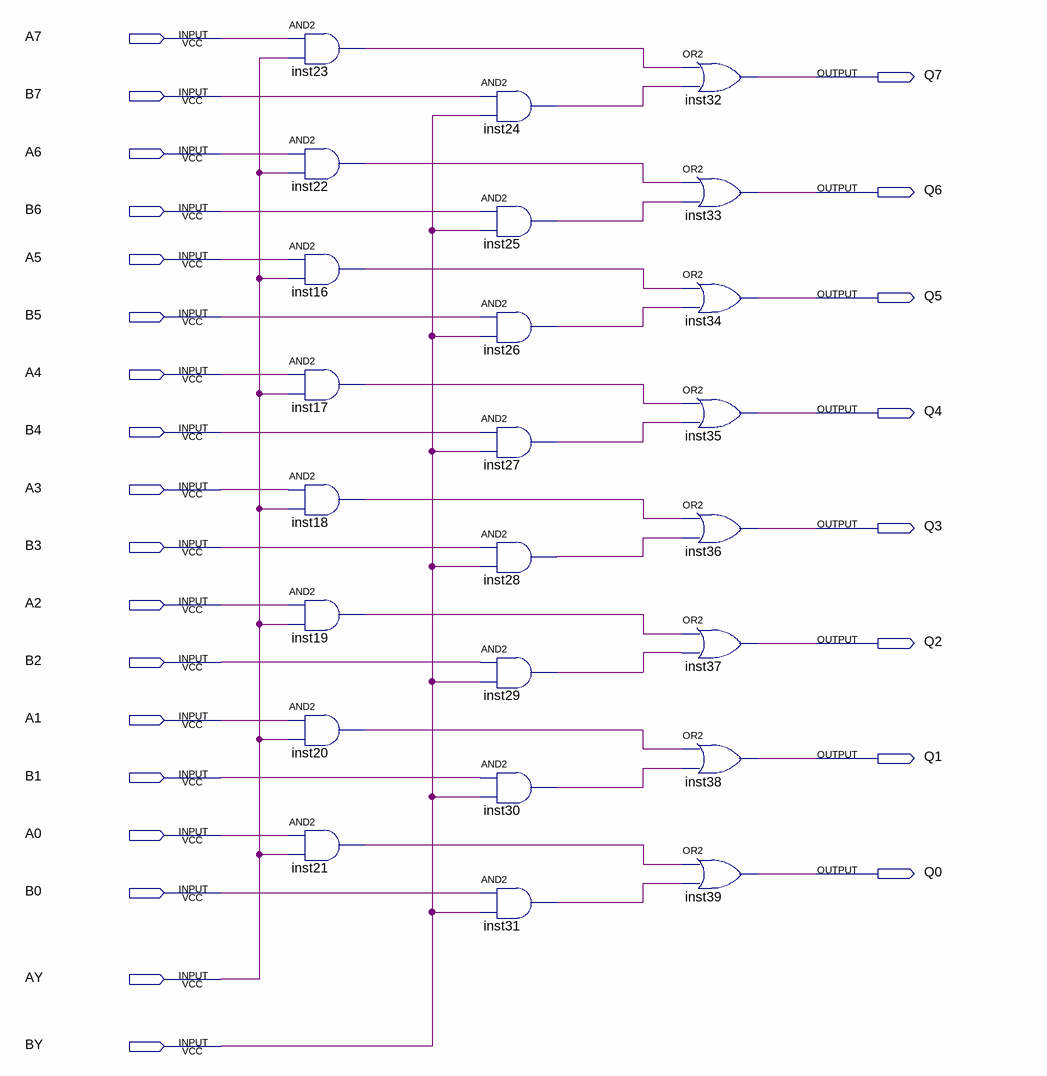
[diagram p0: schematic sheet]
// Quartus schematic tmux8.bdf as structural Verilog: 24 symbols, 26 pins
module tmux8 (
  input  A7,
  input  B7,
  input  A6,
  input  B6,
  input  A5,
  input  B5,
  input  A4,
  input  B4,
  input  A3,
  input  B3,
  input  A2,
  input  B2,
  input  A1,
  input  B1,
  input  A0,
  input  B0,
  input  AY,
  input  BY,
  output Q7,
  output Q6,
  output Q5,
  output Q4,
  output Q3,
  output Q2,
  output Q1,
  output Q0
);

  wire inst16_out, inst17_out, inst18_out, inst19_out, inst20_out, inst21_out, inst22_out, inst23_out,
       inst24_out, inst25_out, inst26_out, inst27_out, inst28_out, inst29_out, inst30_out, inst31_out;

  and inst23 (inst23_out, A7, AY);
  and inst22 (inst22_out, A6, AY);
  and inst16 (inst16_out, A5, AY);
  and inst17 (inst17_out, A4, AY);
  and inst18 (inst18_out, A3, AY);
  and inst19 (inst19_out, A2, AY);
  and inst20 (inst20_out, A1, AY);
  and inst21 (inst21_out, A0, AY);
  and inst24 (inst24_out, B7, BY);
  and inst25 (inst25_out, B6, BY);
  and inst26 (inst26_out, B5, BY);
  and inst27 (inst27_out, B4, BY);
  and inst28 (inst28_out, B3, BY);
  and inst29 (inst29_out, B2, BY);
  and inst30 (inst30_out, B1, BY);
  and inst31 (inst31_out, B0, BY);
  or inst32 (Q7, inst23_out, inst24_out);
  or inst33 (Q6, inst22_out, inst25_out);
  or inst34 (Q5, inst16_out, inst26_out);
  or inst35 (Q4, inst17_out, inst27_out);
  or inst36 (Q3, inst18_out, inst28_out);
  or inst37 (Q2, inst19_out, inst29_out);
  or inst38 (Q1, inst20_out, inst30_out);
  or inst39 (Q0, inst21_out, inst31_out);
endmodule
